# EAGLE schematic Schematic_IOT_Project_v31 (EAGLE 9.7.0)
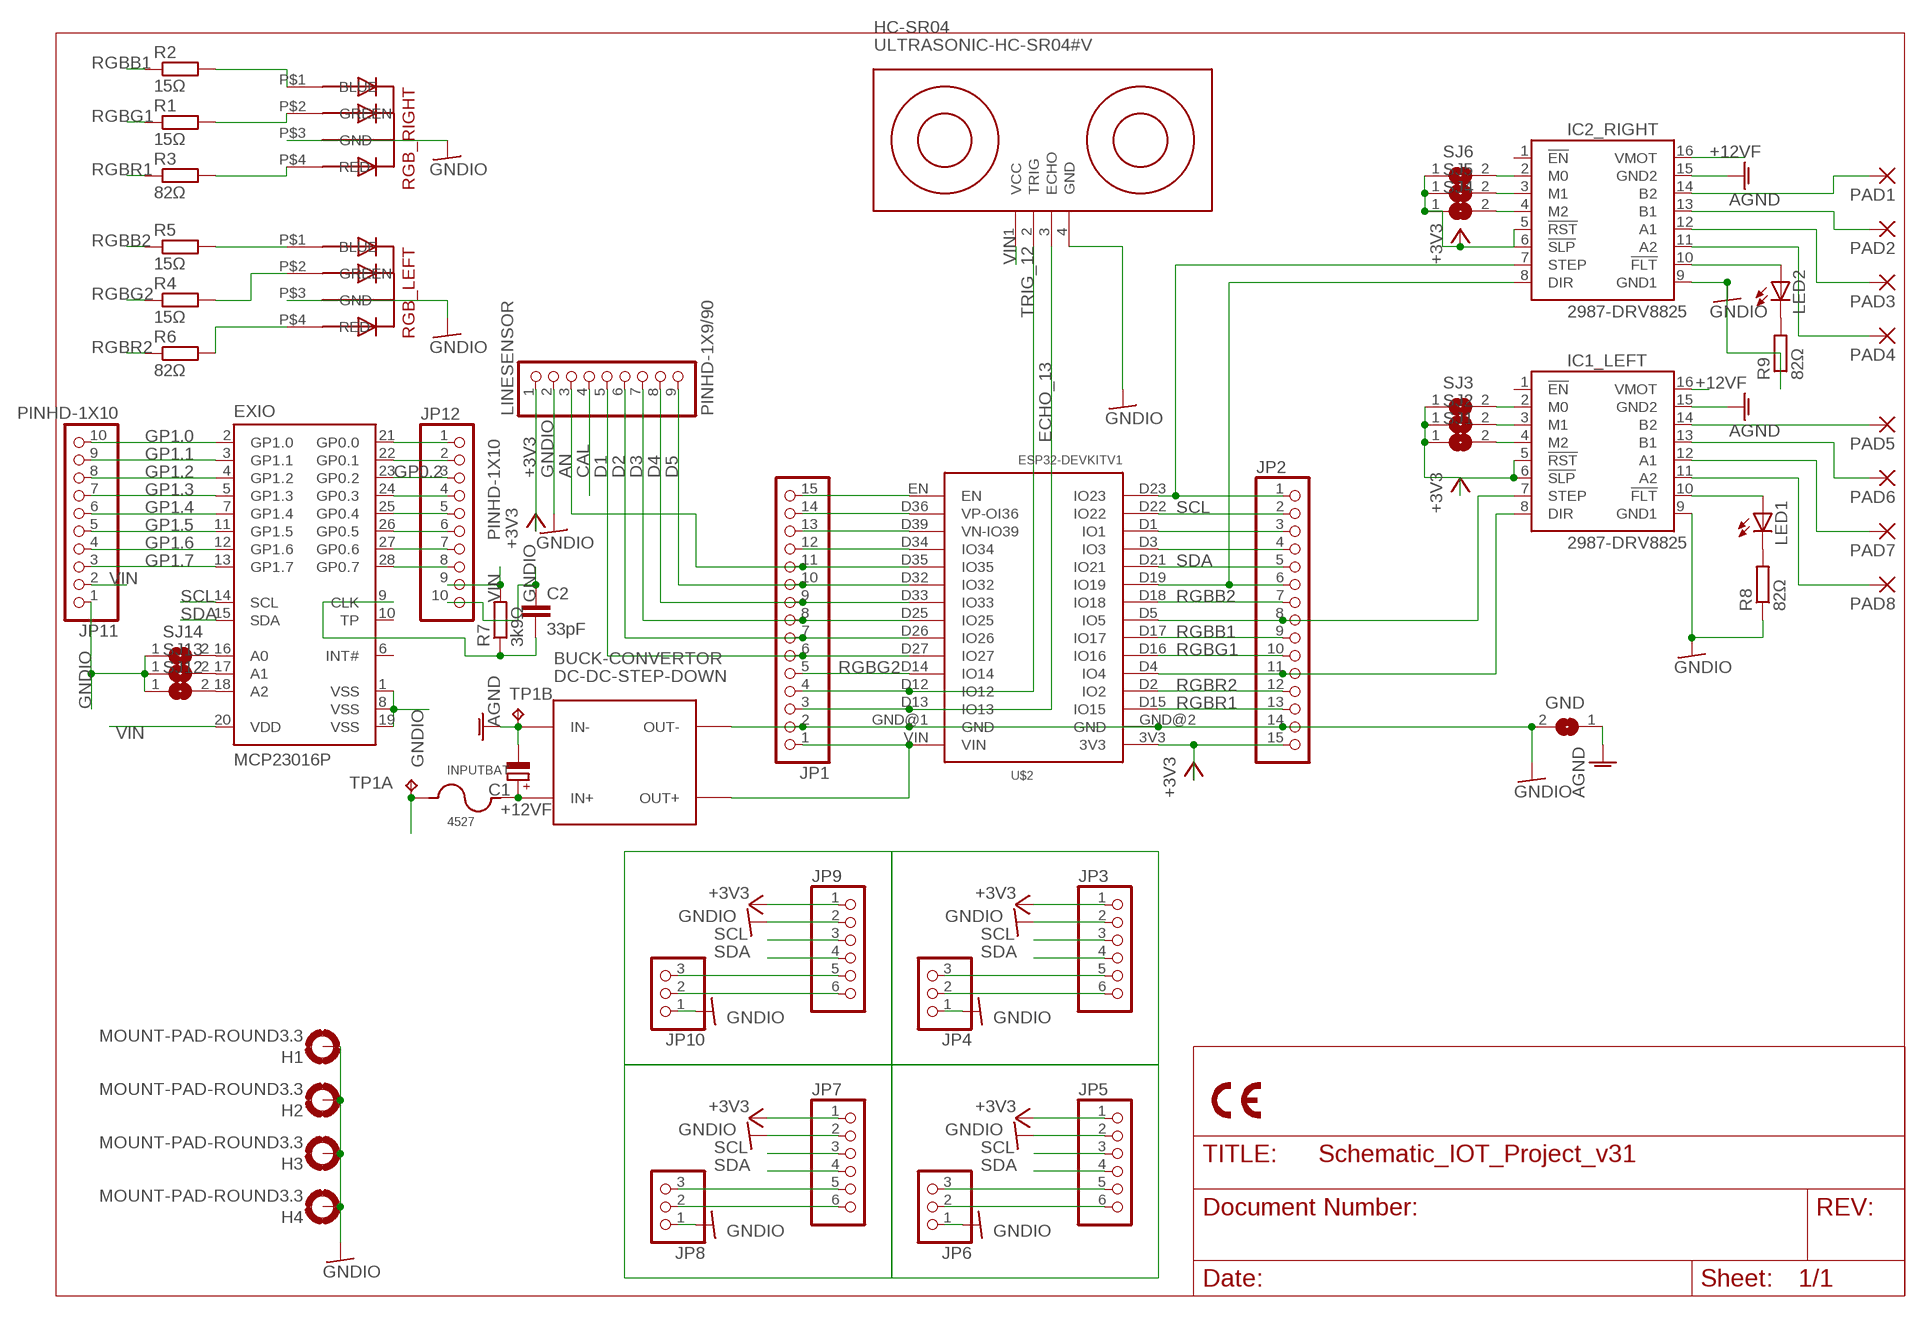
[diagram p0: schematic, sheet 1]

## Parts
BUCK-CONVERTOR  DC-DC-STEP-DOWN  DC-DC-STEP-DOWN-MP2307  [DC-DC-STEP-DOWN-MP2307]
C1  CPOL-EUE2,5-6E  [E2,5-6E]
C2  33pF  C-EU025-024X044  [C025-024X044]
EXIO  MCP23016P  [DIL28-3]
GND  SJ  [SJ]
H1  MOUNT-PAD-ROUND3.3  [3,3-PAD]
H2  MOUNT-PAD-ROUND3.3  [3,3-PAD]
H3  MOUNT-PAD-ROUND3.3  [3,3-PAD]
H4  MOUNT-PAD-ROUND3.3  [3,3-PAD]
HC-SR04  ULTRASONIC-HC-SR04#V  [ULTRASONIC-HC-SR04#V]
IC1_LEFT  2987-DRV8825  [DRV8825]
IC2_RIGHT  2987-DRV8825  [DRV8825]
INPUTBAT  4527  [4527]
JP1  PINHD-1X15  [1X15]
JP2  PINHD-1X15  [1X15]
JP3  PINHD-1X6  [1X06]
JP4  PINHD-1X3  [1X03]
JP5  PINHD-1X6  [1X06]
JP6  PINHD-1X3  [1X03]
JP7  PINHD-1X6  [1X06]
JP8  PINHD-1X3  [1X03]
JP9  PINHD-1X6  [1X06]
JP10  PINHD-1X3  [1X03]
JP11  PINHD-1X10  [1X10]
JP12  PINHD-1X10  [1X10]
LED1  LED3MM  [LED3MM]
LED2  LED3MM  [LED3MM]
LINESENSOR  PINHD-1X9/90  [1X09/90]
PAD1  1,6/0,8  [1,6/0,8]
PAD2  1,6/0,8  [1,6/0,8]
PAD3  1,6/0,8  [1,6/0,8]
PAD4  1,6/0,8  [1,6/0,8]
PAD5  1,6/0,8  [1,6/0,8]
PAD6  1,6/0,8  [1,6/0,8]
PAD7  1,6/0,8  [1,6/0,8]
PAD8  1,6/0,8  [1,6/0,8]
R1  15Ω  R-EU_0204/7  [0204/7]
R2  15Ω  R-EU_0204/7  [0204/7]
R3  82Ω  R-EU_0204/7  [0204/7]
R4  15Ω  R-EU_0204/7  [0204/7]
R5  15Ω  R-EU_0204/7  [0204/7]
R6  82Ω  R-EU_0204/7  [0204/7]
R7  3k9Ω  R-EU_0204/7  [0204/7]
R8  82Ω  R-EU_0204/7  [0204/7]
R9  82Ω  R-EU_0204/7  [0204/7]
RGB_LEFT  5MMRGBLED  [LED5MMRGB]
RGB_RIGHT  5MMRGBLED  [LED5MMRGB]
SJ1  SJ  [SJ]
SJ2  SJ  [SJ]
SJ3  SJ  [SJ]
SJ4  SJ  [SJ]
SJ5  SJ  [SJ]
SJ6  SJ  [SJ]
SJ12  SJ  [SJ]
SJ13  SJ  [SJ]
SJ14  SJ  [SJ]
TP1  TP2P2-38-17  [P2-38-17]
U$2  ESP32DEVKITV1  [ESP32-DEVKITV1]

## Nets
+3V3: IC1_LEFT.5(!RST) IC1_LEFT.6(!SLP) IC2_RIGHT.5(!RST) IC2_RIGHT.6(!SLP) JP2.15 JP3.1 JP5.1 JP7.1 JP9.1 LINESENSOR.1 SJ1.1 SJ2.1 SJ3.1 SJ4.1 SJ5.1 SJ6.1 U$2.3V3
+12VF: BUCK-CONVERTOR.IN+ C1.+ IC1_LEFT.16(VMOT) IC2_RIGHT.16(VMOT) INPUTBAT.2
AGND: BUCK-CONVERTOR.IN- C1.- GND.1 IC1_LEFT.15(GND2) IC2_RIGHT.15(GND2) TP1.TP-2
AN: JP1.11 LINESENSOR.3 U$2.D35(IO35)
CAL: LINESENSOR.4
D1: JP1.6 LINESENSOR.5 U$2.D27(IO27)
D2: JP1.7 LINESENSOR.6 U$2.D26(IO26)
D3: JP1.8 LINESENSOR.7 U$2.D25(IO25)
D4: JP1.9 LINESENSOR.8 U$2.D33(IO33)
D5: JP1.10 LINESENSOR.9 U$2.D32(IO32)
ECHO_13: HC-SR04.3(ECHO) JP1.3 U$2.D13(IO13)
GNDIO: BUCK-CONVERTOR.OUT- C2.1 EXIO.1(VSS) EXIO.8(VSS) EXIO.19(VSS) GND.2 H1.B3,3(MOUNT) H2.B3,3(MOUNT) H3.B3,3(MOUNT) H4.B3,3(MOUNT) HC-SR04.4(GND) IC1_LEFT.9(GND1) IC2_RIGHT.9(GND1) JP1.2 JP2.14 JP3.2 JP4.1 JP5.2 JP6.1 JP7.2 JP8.1 JP9.2 JP10.1 JP11.1 JP12.10 LINESENSOR.2 R8.1 R9.1 RGB_LEFT.P$3(GND) RGB_RIGHT.P$3(GND) SJ12.1 SJ13.1 SJ14.1 U$2.GND@1(GND) U$2.GND@2(GND)
GP0.0: EXIO.21(GP0.0) JP12.1
GP0.1: EXIO.22(GP0.1) JP12.2
GP0.2: EXIO.23(GP0.2) JP12.3
GP0.3: EXIO.24(GP0.3) JP12.4
GP0.4: EXIO.25(GP0.4) JP12.5
GP0.5: EXIO.26(GP0.5) JP12.6
GP0.6: EXIO.27(GP0.6) JP12.7
GP0.7: EXIO.28(GP0.7) JP12.8
GP1.0: EXIO.2(GP1.0) JP11.10
GP1.1: EXIO.3(GP1.1) JP11.9
GP1.2: EXIO.4(GP1.2) JP11.8
GP1.3: EXIO.5(GP1.3) JP11.7
GP1.4: EXIO.7(GP1.4) JP11.6
GP1.5: EXIO.11(GP1.5) JP11.5
GP1.6: EXIO.12(GP1.6) JP11.4
GP1.7: EXIO.13(GP1.7) JP11.3
IO23: IC2_RIGHT.7(STEP) JP2.1 U$2.D23(IO23)
N$1: R3.2 RGB_RIGHT.P$4(RED)
N$2: R1.2 RGB_RIGHT.P$2(GREEN)
N$3: IC1_LEFT.7(STEP) JP2.8 U$2.D5(IO5)
N$4: IC2_RIGHT.8(DIR) JP2.6 U$2.D19(IO19)
N$5: R2.2 RGB_RIGHT.P$1(BLUE)
N$6: IC1_LEFT.8(DIR) JP2.11 U$2.D4(IO4)
N$7: R4.2 RGB_LEFT.P$2(GREEN)
N$8: IC1_LEFT.4(M2) SJ1.2
N$9: IC1_LEFT.3(M1) SJ2.2
N$10: IC1_LEFT.2(M0) SJ3.2
N$11: R5.2 RGB_LEFT.P$1(BLUE)
N$12: R6.2 RGB_LEFT.P$4(RED)
N$14: IC2_RIGHT.4(M2) SJ4.2
N$15: IC2_RIGHT.3(M1) SJ5.2
N$16: IC2_RIGHT.2(M0) SJ6.2
N$17: IC2_RIGHT.14(B2) PAD1.1(P)
N$18: IC2_RIGHT.13(B1) PAD2.1(P)
N$19: IC2_RIGHT.12(A1) PAD3.1(P)
N$20: IC2_RIGHT.11(A2) PAD4.1(P)
N$21: IC1_LEFT.14(B2) PAD5.1(P)
N$22: IC1_LEFT.13(B1) PAD6.1(P)
N$23: IC1_LEFT.12(A1) PAD7.1(P)
N$24: IC1_LEFT.11(A2) PAD8.1(P)
N$25: LED1.K(C) R8.2
N$26: IC1_LEFT.10(!FLT) LED1.A
N$27: LED2.K(C) R9.2
N$28: JP2.3 U$2.D1(IO1)
N$29: JP2.4 U$2.D3(IO3)
N$30: IC2_RIGHT.10(!FLT) LED2.A
N$31: JP1.15 U$2.EN
N$32: JP1.14 U$2.D36(VP-OI36)
N$33: JP1.13 U$2.D39(VN-IO39)
N$34: JP1.12 U$2.D34(IO34)
N$36: JP5.5 JP6.3
N$37: JP5.6 JP6.2
N$38: JP3.5 JP4.3
N$40: JP3.6 JP4.2
N$41: JP7.5 JP8.3
N$42: JP7.6 JP8.2
N$44: JP9.5 JP10.3
N$45: JP9.6 JP10.2
N$54: C2.2 EXIO.9(CLK) R7.1
N$55: INPUTBAT.1 TP1.TP-1
N$56: EXIO.18(A2) SJ12.2
N$57: EXIO.17(A1) SJ13.2
N$58: EXIO.16(A0) SJ14.2
RGBB1: JP2.9 R2.1 U$2.D17(IO17)
RGBB2: JP2.7 R5.1 U$2.D18(IO18)
RGBG1: JP2.10 R1.1 U$2.D16(IO16)
RGBG2: JP1.5 R4.1 U$2.D14(IO14)
RGBR1: JP2.13 R3.1 U$2.D15(IO15)
RGBR2: JP2.12 R6.1 U$2.D2(IO2)
SCL: EXIO.14(SCL) JP2.2 JP3.3 JP5.3 JP7.3 JP9.3 U$2.D22(IO22)
SDA: EXIO.15(SDA) JP2.5 JP3.4 JP5.4 JP7.4 JP9.4 U$2.D21(IO21)
TRIG_12: HC-SR04.2(TRIG) JP1.4 U$2.D12(IO12)
VIN: BUCK-CONVERTOR.OUT+ EXIO.20(VDD) HC-SR04.1(VCC) JP1.1 JP11.2 JP12.9 R7.2 U$2.VIN
Unconnected: EXIO.6(INT#) EXIO.10(TP) IC1_LEFT.1(!EN) IC2_RIGHT.1(!EN)

## Library data of the parts
BUCK-CONVERTOR = diy-modules:DC-DC-STEP-DOWN-MP2307: DC/DC Step-Down Regulator based on MP2307DN chip MP2307 datasheet available here: https://cdn-shop.adafruit.com/datasheets/MP2307_r1.9.pdf Click here to find device on ebay.com <http://www.ebay.com/sch/dc+dc+3a+mini+converter>
C1 = rcl:CPOL-EU: POLARIZED CAPACITOR, European symbol; SPICEPREFIX: C
C2 = rcl:C-EU: CAPACITOR, European symbol; SPICEPREFIX: C
EXIO = microchip-dspic:MCP23016: 16-Bit I/O Expander with I2C Interface
GND SJ1-SJ6 SJ12-SJ14 = jumper:SJ: SMD solder JUMPER
H1-H4 = holes:MOUNT-PAD-ROUND: MOUNTING PAD, round
HC-SR04 = diy-modules:ULTRASONIC-HC-SR04: Ultrasonic Ranging Module HC-SR04 More details available here: http://randomnerdtutorials.com/complete-guide-for-ultrasonic-sensor-hc-sr04/ Click here to find device on ebay.com <http://www.ebay.com/sch/hc+sr04+ultrasonic>
IC1_LEFT IC2_RIGHT = pololu-stepper-driver:2987-DRV8825: DRV8825 Stepper Motor Driver Carrier; High Current (Bulk; Header Pins Soldered) #2987 DRV8825 Stepper Motor Driver Carrier; High Current (Bulk; Header Pins Soldered) <https://www.pololu.com/product/2987> in Japan, Suzaku Lab. Ltd. <https://suzakugiken.jp/> #2987 DRV8825 大電流ステッピングモータドライバボード (バルク品 ピンヘッダ実装済み) <https://szc.jp/po2987>
INPUTBAT = Fuse Holder:4527: FUSE HLDR CARTRIDGE 250V 5A PCB Manufacturer's datasheet <https://www.keyelco.com/userAssets/file/M65p44.pdf>; CREATED_BY: PCBLayout.com; DIGIKEY_PN: 36-4527-ND; MANUFACTURER: Keystone Electronics; MPN: 4527
JP1 JP2 = adafruit:PINHD-1X15: PIN HEADER
JP3 JP5 JP7 JP9 = adafruit:PINHD-1X6: PIN HEADER
JP4 JP6 JP8 JP10 = adafruit:PINHD-1X3: PIN HEADER
JP11 JP12 = Connector:PINHD-1X10: PIN HEADER; CATEGORY: CONNECTOR; SUB-CATEGORY: PIN-HEADER
LED1 LED2 = adafruit:LED: LED OSRAM: - CHIPLED LG R971, LG N971, LY N971, LG Q971, LY Q971, LO R971, LY R971 LH N974, LH R974 LS Q976, LO Q976, LY Q976 LO Q996 - Hyper CHIPLED LW Q18S LB Q993, LB Q99A, LB R99A - SideLED LS A670, LO A670, LY A670, LG A670, LP A670 LB A673, LV A673, LT A673, LW A673 LH A674 LY A675 LS A676, LA A676, LO A676, LY A676, LW A676 LS A679, LY A679, LG A679 - Hyper Micro SIDELED® LS Y876, LA Y876, LO Y876, LY Y876 LT Y87S - SmartLED LW L88C, LW L88S LB L89C, LB L89S, LG L890 LS L89K, LO L89K, LY L89K LS L896, LA L896, LO L896, LY L896 - TOPLED LS T670, LO T670, LY T670, LG T670, LP T670 LSG T670, LSP T670, LSY T670, LOP T670, LYG T670 LG T671, LOG T671, LSG T671 LB T673, LV T673, LT T673, LW T673 LH T674 LS T676, LA T676, LO T676, LY T676, LB T676, LH T676, LSB T676, LW T676 LB T67C, LV T67C, LT T67C, LS T67K, LO T67K, LY T67K, LW E67C LS E67B, LA E67B, LO E67B, LY E67B, LB E67C, LV E67C, LT E67C LW T67C LS T679, LY T679, LG T679 LS T770, LO T770, LY T770, LG T770, LP T770 LB T773, LV T773, LT T773, LW T773 LH T774 LS E675, LA E675, LY E675, LS T675 LS T776, LA T776, LO T776, LY T776, LB T776 LHGB T686 LT T68C, LB T68C - Hyper Mini TOPLED® LB M676 - Mini TOPLED Santana® LG M470 LS M47K, LO M47K, LY M47K Source: http://www.osram.convergy.de/
LINESENSOR = Connector:PINHD-1X9: PIN HEADER; CATEGORY: CONNECTOR; SUB-CATEGORY: PIN-HEADER
PAD1-PAD8 = wirepad:1,6/0,8: THROUGH-HOLE PAD
R1-R9 = rcl:R-EU_: RESISTOR, European symbol; SPICEPREFIX: R
RGB_LEFT RGB_RIGHT = led_rgb:5MMRGBLED
TP1 = testpad:TP2: Test pad
U$2 = ESP32-DEVKITV1 updated:ESP32DEVKITV1